# EAGLE design amiga_external_floppy_adapter_rev3 (EAGLE 9.7.0)
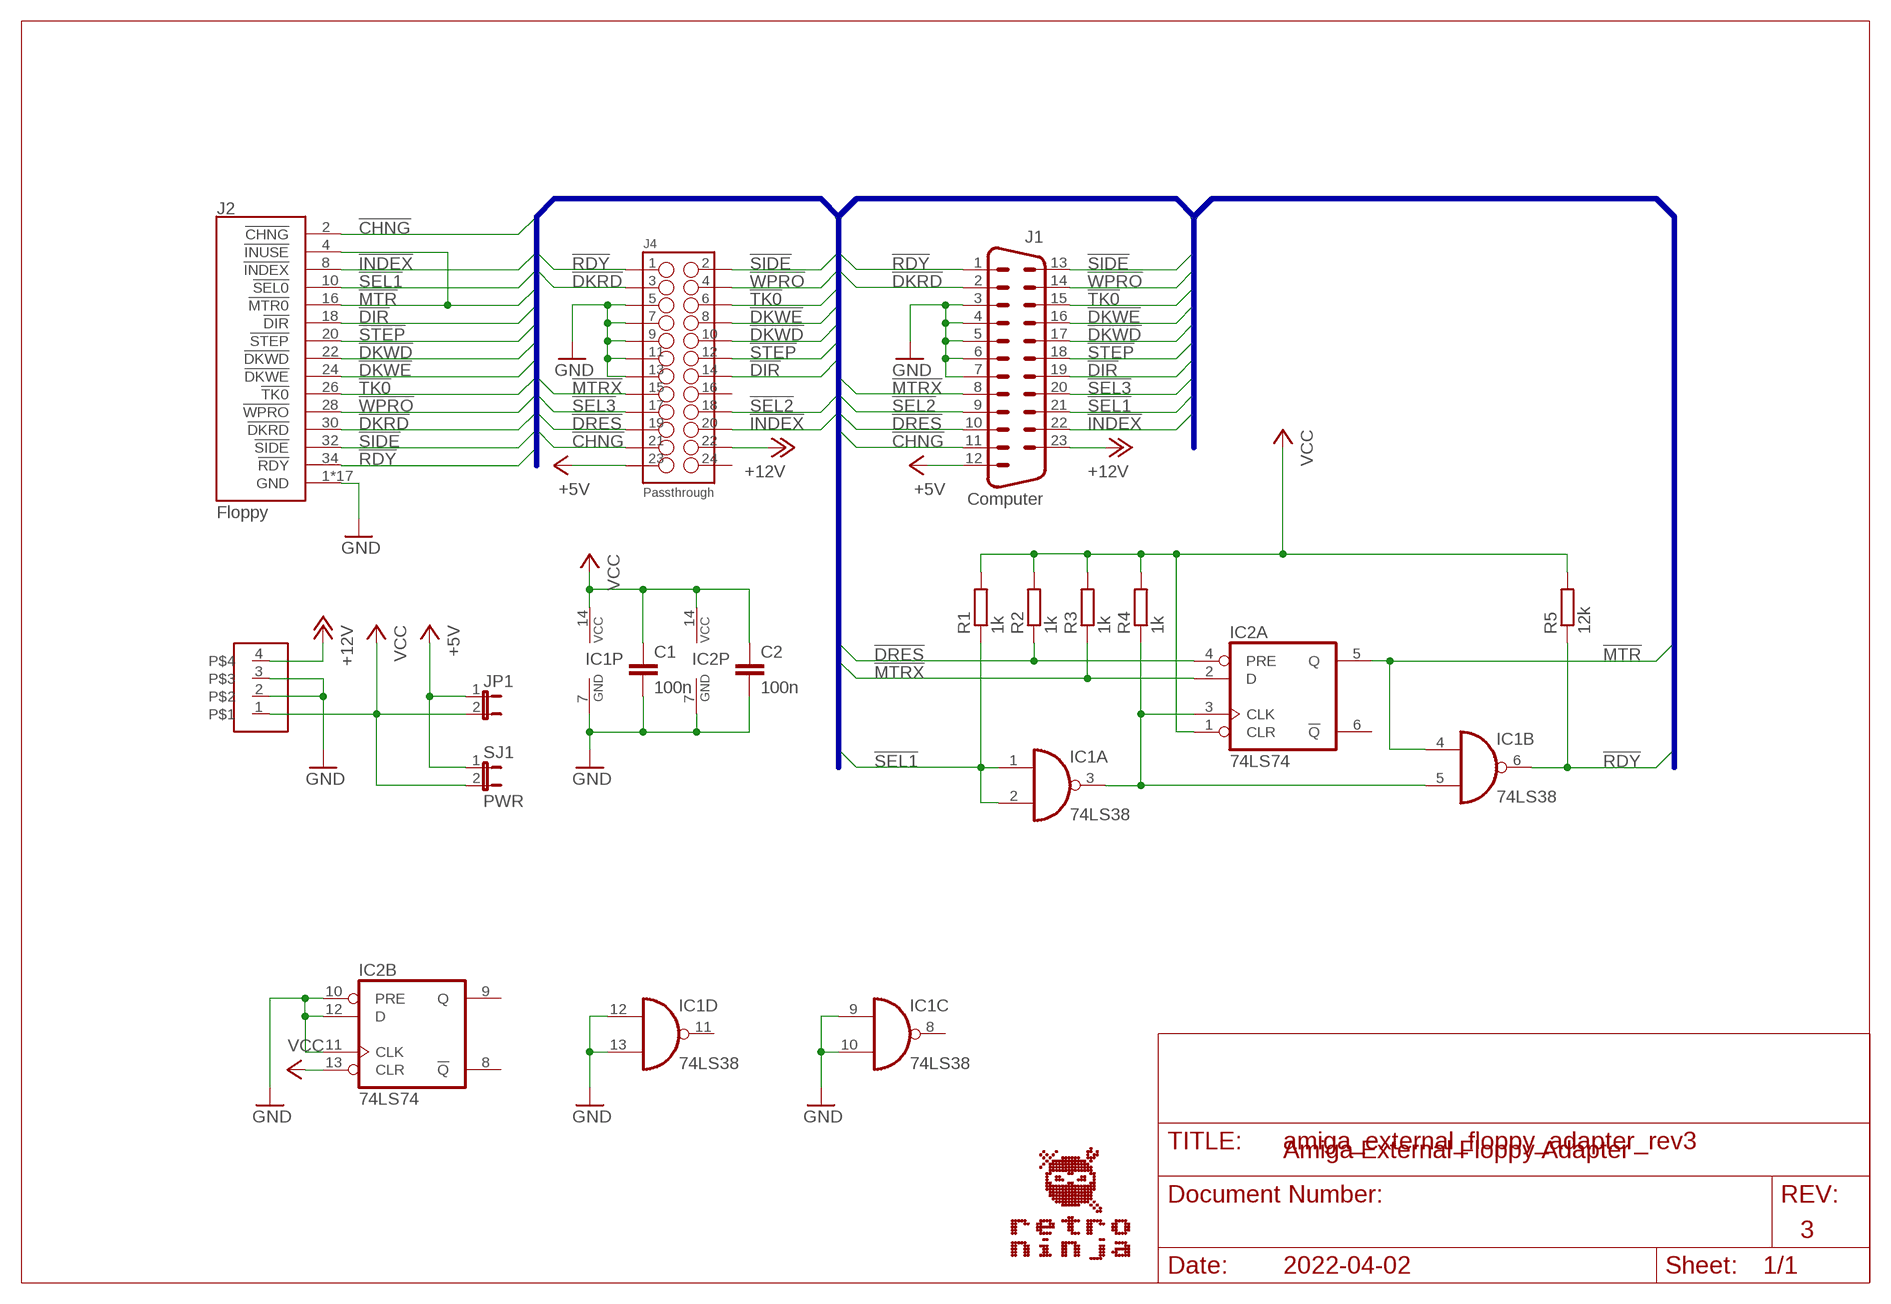
[diagram p0: schematic, sheet 1]

## Parts
C1  100n  CAPACITOR-5  [CAP_5MM_2.5X5.0_ROUND]
C2  100n  CAPACITOR-5  [CAP_5MM_2.5X5.0_ROUND]
IC1  74LS38  7438_DIL14  [DIL14]
IC2  74LS74  74LS74N  [DIL14]
J1  Computer  DSUB_M23  [DSUB_M23D]
J2  Floppy  AMIGA_FLOPPYDRV_CONNECTOR/IDC  [HEADER_2X17_WALLED]
J3  HEADER_1X4_2.50MM_RIGHT  [HEADER_1X4_2.50_RIGHT]
J4  Passthrough  HEADER_2X12/IDC  [HEADER_2X12_WALLED]
JP1  JUMPER-2  [HEADER_1X2]
R1  1k  R-EU_0207/10  [0207/10]
R2  1k  R-EU_0207/10  [0207/10]
R3  1k  R-EU_0207/10  [0207/10]
R4  1k  R-EU_0207/10  [0207/10]
R5  12k  R-EU_0207/10  [0207/10]
SJ1  PWR  JUMPER-2SJ  [SJ-2]

## Nets
!CHNG: J1.11 J2.2(!CHNG) J4.21
!DIR: J1.19 J2.18(!DIR) J4.14
!DKRD: J1.2 J2.30(!DKRD) J4.3
!DKWD: J1.17 J2.22(!DKWD) J4.10
!DKWE: J1.16 J2.24(!DKWE) J4.8
!DRES: IC2.4(A:PRE) J1.10 J4.19 R2.1
!INDEX: J1.22 J2.8(!INDEX) J4.20
!MTR: IC1.4(B:I0) IC2.5(A:Q) J2.4(!INUSE) J2.16(!MTR0)
!MTRX: IC2.2(A:D) J1.8 J4.15 R3.1
!RDY: IC1.6(B:O) J1.1 J2.34(!RDY) J4.1 R5.1
!SEL1: IC1.1(A:I0) IC1.2(A:I1) J1.21 J2.10(!SEL0) R1.1
!SEL2: J1.9 J4.18
!SEL3: J1.20 J4.17
!SIDE: J1.13 J2.32(!SIDE) J4.2
!STEP: J1.18 J2.20(!STEP) J4.12
!TK0: J1.15 J2.26(!TK0) J4.6
!WPRO: J1.14 J2.28(!WPRO) J4.4
+5V: J1.12 J4.23 JP1.1 SJ1.1
+12V: J1.23 J3.4 J4.22
GND: C1.2 C2.2 IC1.7(P:GND) IC1.9(C:I0) IC1.10(C:I1) IC1.12(D:I0) IC1.13(D:I1) IC2.7(P:GND) IC2.10(B:PRE) IC2.11(B:CLK) IC2.12(B:D) J1.3 J1.4 J1.5 J1.6 J1.7 J2.1(GND) J2.3(GND) J2.5(GND) J2.7(GND) J2.9(GND) J2.11(GND) J2.13(GND) J2.15(GND) J2.17(GND) J2.19(GND) J2.21(GND) J2.23(GND) J2.25(GND) J2.27(GND) J2.29(GND) J2.31(GND) J2.33(GND) J3.2 J3.3 J4.5 J4.7 J4.9 J4.11 J4.13
N$1: IC1.3(A:O) IC1.5(B:I1) IC2.3(A:CLK) R4.1
VCC: C1.1 C2.1 IC1.14(P:VCC) IC2.1(A:CLR) IC2.13(B:CLR) IC2.14(P:VCC) J3.1 JP1.2 R1.2 R2.2 R3.2 R4.2 R5.2 SJ1.2
Unconnected: IC1.8(C:O) IC1.11(D:O) IC2.6(A:!Q) IC2.8(B:!Q) IC2.9(B:Q) J4.16 J4.24

## Buses
DATA:!CHNG,!DIR,!DKRD,!DKWD,!DKWE,!DRES,!INDEX,!INUSE,!MTR,!MTRX,!RDY,!SEL1,!SEL2,!SEL3,!SIDE,!STEP,!TK0,!WPRO

## Notes on the sheet
- Amiga External Floppy Adapter
- 3
- 2022-04-02

## Library data of the parts
C1 C2 = Per (Fusion 360):CAPACITOR
IC1 = Per (Fusion 360):74*38
IC2 = 74xx-eu:74*74: Dual D type positive edge triggered FLIP FLOP, preset and clear
J1 = Per (Fusion 360):DSUB_M23
J2 = Per (Fusion 360):AMIGA_FLOPPYDRV_CONNECTOR
J3 = Per (Fusion 360):HEADER_1X4
J4 = Per (Fusion 360):HEADER_2X12
JP1 SJ1 = Per (Fusion 360):JUMPER-2
R1-R5 = rcl:R-EU_: RESISTOR, European symbol; SPICEPREFIX: R

## Board
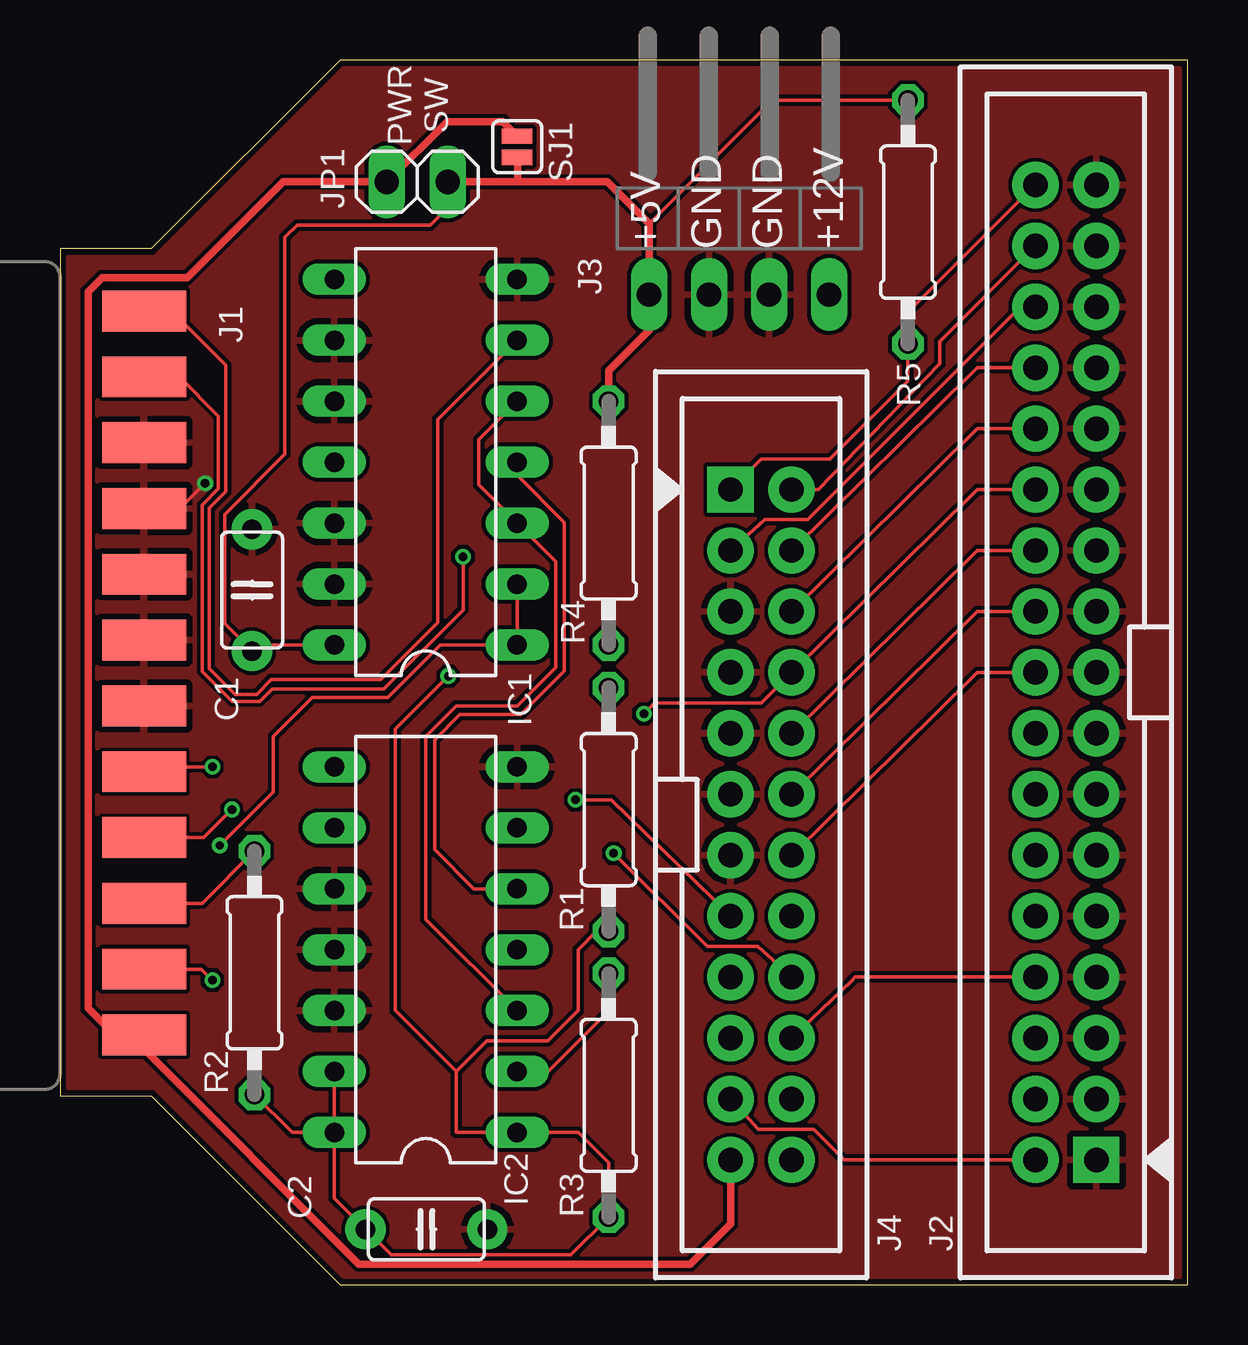
[diagram p1: board, top side]
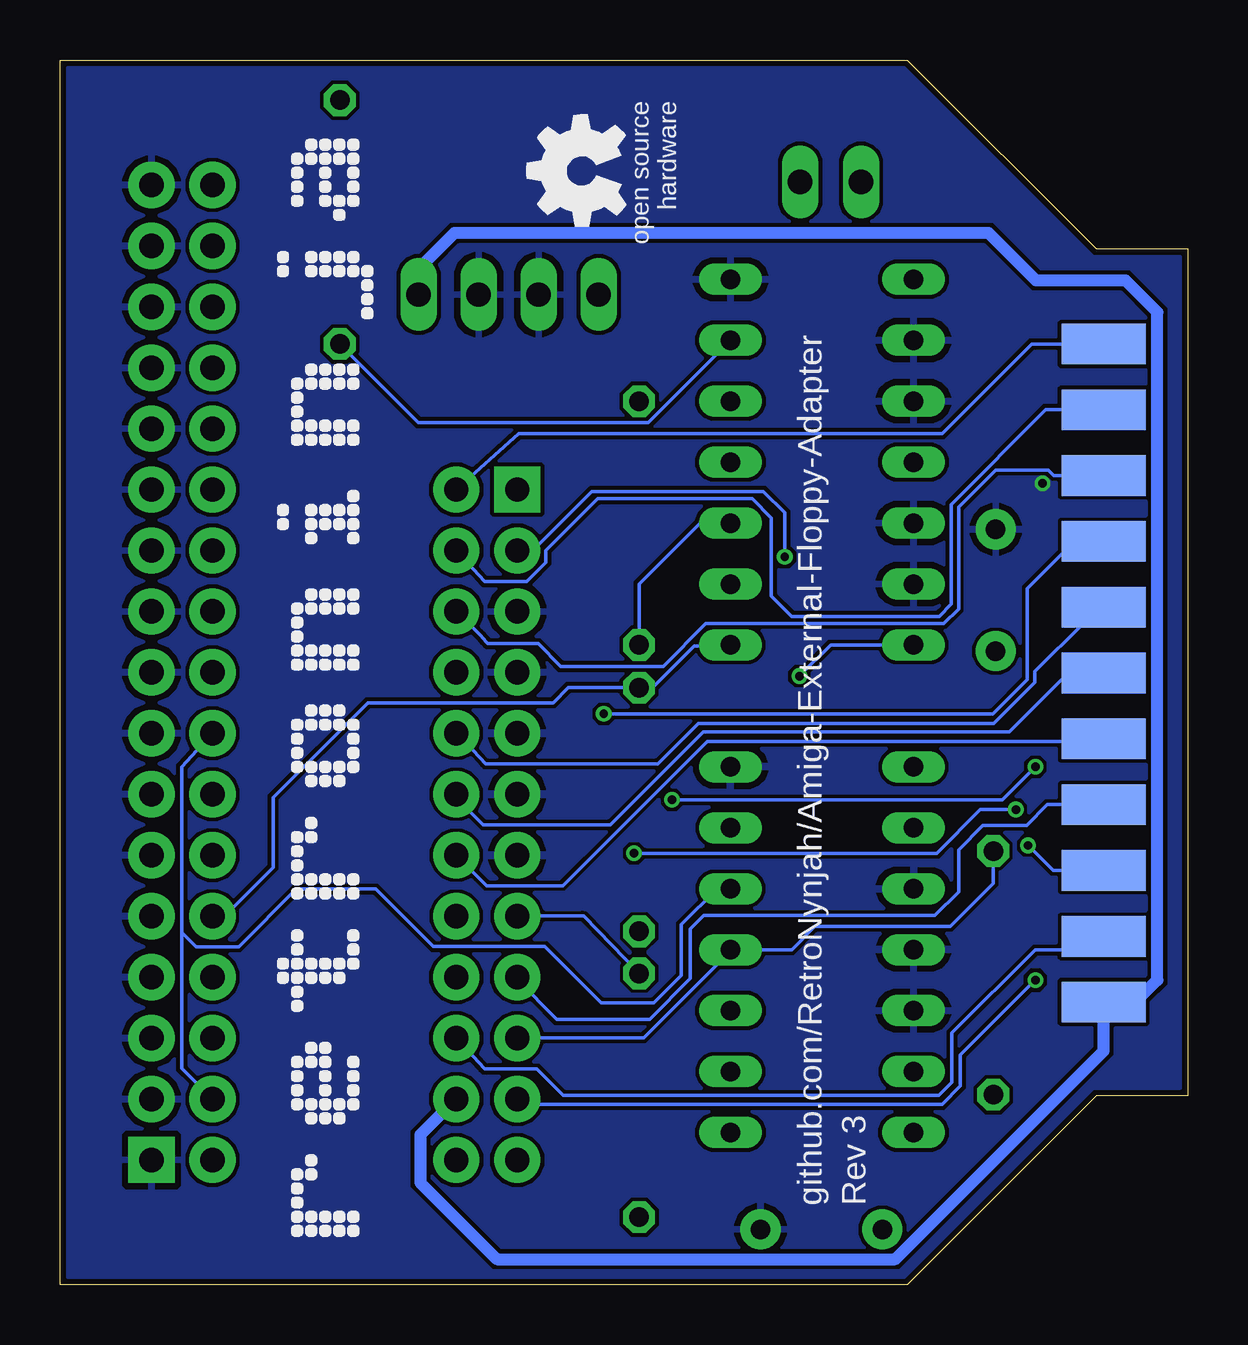
[diagram p2: board, bottom side, seen from below]

Size 46.99 x 51.05 mm. Coordinates in mm from the lower left corner, seen from the top.
Outline: 0,43.18 0,7.87 3.81,7.87 11.68,0 46.99,0 46.99,51.05 11.68,51.05 3.81,43.18 0,43.18
Copper layers (1*16): Top 0.035mm / dielectric 1.5mm / Bottom 0.035mm
Design rules "SeeedStudio_2layer_DRU_no_angle_20140221": minimum track width 6mil, minimum drill 12mil, track to track 6mil, track to pad 6mil, pad to pad 6mil, via to via 6mil, smd to smd 0mil, copper to edge 10mil, drill to drill 10mil, minimum pad ring 10mil, minimum via ring 6mil, stop-mask expansion 2mil, vias tented up to drill 100mil, thermal gap 10mil

### Footprints (pad centres in the part's own frame; a part is rotated, then mirrored left to right if it is on the bottom)
CAP_5MM_2.5X5.0_ROUND = drill 0.813 pad 1.676: 1 -2.54,0; 2 2.54,0
DIL14 = drill 0.813 long: 1 -7.62,-3.81; 2 -5.08,-3.81; 3 -2.54,-3.81; 4 0,-3.81; 5 2.54,-3.81; 6 5.08,-3.81; 7 7.62,-3.81; 8 7.62,3.81; 9 5.08,3.81; 10 2.54,3.81; 11 0,3.81; 12 -2.54,3.81; 13 -5.08,3.81; 14 -7.62,3.81
DSUB_M23D = smd 1.7 x 3.5: 1 17.729,-12.395; 2 14.986,-12.395; 3 12.243,-12.395; 4 9.5,-12.395; 5 6.756,-12.395; 6 4.013,-12.395; 7 1.27,-12.395; 8 -1.473,-12.395; 9 -4.216,-12.395; 10 -6.96,-12.395; 11 -9.703,-12.395; 12 -12.446,-12.395 | smd 1.7 x 3.5 bottom: 13 16.358,-12.395; 14 13.614,-12.395; 15 10.871,-12.395; 16 8.128,-12.395; 17 5.385,-12.395; 18 2.642,-12.395; 19 -0.102,-12.395; 20 -2.845,-12.395; 21 -5.588,-12.395; 22 -8.331,-12.395; 23 -11.074,-12.395
HEADER_2X17_WALLED = drill 1.016 pad 1.93 square: 1 -5.08,-1.27 | drill 1.016 pad 1.93: 2 -5.08,1.27; 3 -2.54,-1.27; 4 -2.54,1.27; 5 0,-1.27; 6 0,1.27; 7 2.54,-1.27; 8 2.54,1.27; 9 5.08,-1.27; 10 5.08,1.27; 11 7.62,-1.27; 12 7.62,1.27; 13 10.16,-1.27; 14 10.16,1.27; 15 12.7,-1.27; 16 12.7,1.27; 17 15.24,-1.27; 18 15.24,1.27; 19 17.78,-1.27; 20 17.78,1.27; 21 20.32,-1.27; 22 20.32,1.27; 23 22.86,-1.27; 24 22.86,1.27; 25 25.4,-1.27; 26 25.4,1.27; 27 27.94,-1.27; 28 27.94,1.27; 29 30.48,-1.27; 30 30.48,1.27; 31 33.02,-1.27; 32 33.02,1.27; 33 35.56,-1.27; 34 35.56,1.27
HEADER_1X4_2.50_RIGHT = drill 1.016 long: 1 -3.75,0; 2 -1.25,0; 3 1.25,0; 4 3.75,0
HEADER_2X12_WALLED = drill 1.016 pad 1.93 square: 1 -13.97,-1.27 | drill 1.016 pad 1.93: 2 -13.97,1.27; 3 -11.43,-1.27; 4 -11.43,1.27; 5 -8.89,-1.27; 6 -8.89,1.27; 7 -6.35,-1.27; 8 -6.35,1.27; 9 -3.81,-1.27; 10 -3.81,1.27; 11 -1.27,-1.27; 12 -1.27,1.27; 13 1.27,-1.27; 14 1.27,1.27; 15 3.81,-1.27; 16 3.81,1.27; 17 6.35,-1.27; 18 6.35,1.27; 19 8.89,-1.27; 20 8.89,1.27; 21 11.43,-1.27; 22 11.43,1.27; 23 13.97,-1.27; 24 13.97,1.27
HEADER_1X2 = drill 1.016 long: 1 -1.27,0; 2 1.27,0
0207/10 = drill 0.813 octagon: 1 -5.08,0; 2 5.08,0
SJ-2 = smd 0.635 x 1.27: 1 -0.889,0; 2 0,0

### Placement (x,y rotation side)
C1  8,28.96 90 top
C2  15.27,2.31 0 top
IC1  15.24,34.29 90 top
IC2  15.24,13.97 90 top
J1  -8.89,22.86 90 top
J2  41.91,10.29 90 top
J3  28.3,41.27 0 top
J4  29.21,19.18 270 top
JP1  14.88,45.97 0 top
R1  22.86,19.81 270 top
R2  8.1,13 270 top
R3  22.86,7.9 270 top
R4  22.86,31.75 90 top
R5  35.33,44.3 90 top
SJ1  19.05,46.99 270 top
U$1  [RETRONINJA_WORD_46X4]  33.93,2.01 90 bottom
U$2  [OSHW_5MM]  25.25,46.43 90 bottom

### Tracks (layer width: path | path; a pad name or v marks a point on that pad's centre or on a via)
!CHNG  (via drill 0.35)
  Top 0.152: J4.21 29.09,6.48 31.41,6.48 32.68,5.21 J2.2 | v6.35,12.7 5.89,13.16 J1.11
  Bottom 0.152: J4.21 27.88,7.52 10.24,7.52 9.47,8.29 9.47,9.58 v6.35,12.7
!DIR
  Top 0.152: J4.14 38.1,25.4 38.23,25.53 J2.18
  Bottom 0.152: J1.19 3.81,22.66 20.03,22.66 26.05,16.64 29.21,16.64 J4.14
!DKRD  (via drill 0.35)
  Top 0.152: J4.3 29.37,31.9 31.17,31.9 40.03,40.77 J2.30 | J1.2 4.98,37.85 6.6,36.22 6.6,33.18 5.92,32.5 5.92,25.57 7.18,24.31 8.31,24.31 8.85,24.84 13.5,24.84 16.79,28.13 v16.79,30.35
  Bottom 0.152: v16.79,30.35 v16.8,30.35 16.8,32.19 17.68,33.07 24.82,33.07 27.29,30.61 J4.3
!DKWD
  Top 0.152: J4.10 38.1,30.48 38.23,30.61 J2.22
  Bottom 0.152: J1.17 4.14,27.61 4.32,27.61 6.38,25.55 6.38,25.11 8.09,23.39 20.4,23.39 22.07,21.72 29.26,21.72 29.77,22.28 J4.10
!DKWE  (via drill 0.35)
  Top 0.152: v24.33,23.8 v24.33,23.81 24.78,24.26 29.21,24.26 J4.8 38.1,33.02 38.23,33.15 J2.24
  Bottom 0.152: J1.16 4.52,31.19 6.68,29.03 6.68,25.24 8.12,23.8 v24.33,23.8
!DRES
  Top 0.152: R2.1 5.92,15.9 J1.10
  Bottom 0.152: R2.1 8.1,16.74 9.91,14.94 15.54,14.94 16.51,13.97 IC2.4 19.05,13.91 22.67,10.29 J4.19
!INDEX
  Top 0.152: J4.20 32.99,12.67 33.15,12.83 J2.8
  Bottom 0.152: J1.22 4.27,13.97 6.35,13.97 9.83,10.49 9.83,8.45 10.38,7.9 26.02,7.9 27.12,8.99 29.3,8.99 J4.20
!MTR
  Top 0.152: IC1.4 19.05,33.74 21.01,31.78 21.01,25.58 19.2,23.77 16.66,23.77 15.61,22.72 15.61,18.14 17.24,16.51 IC2.5
  Bottom 0.152: IC2.5 19.61,16.51 21.11,15.01 21.11,12.89 22.24,11.76 24.44,11.76 26.78,14.1 31.43,14.1 33.84,16.51 37.14,16.51 39.55,14.1 41.31,14.1 41.91,14.7 | 41.91,14.7 41.91,21.59 J2.16 | J2.4 41.91,9.02 41.91,14.7
!MTRX  (via drill 0.35)
  Top 0.152: R3.1 22.78,11.33 20.34,8.89 IC2.2 | J1.8 3.71,21.59 v6.35,21.59 | v21.48,20.21 22.96,20.21 J4.15
  Bottom 0.152: v6.35,21.59 7.72,20.21 v21.48,20.21 | J4.15 25.17,15.37 R3.1
!RDY
  Top 0.152: IC1.6 15.75,36.07 15.75,27.6 13.37,25.22 8.8,25.22 8.19,24.61 7.3,24.61 6.22,25.7 6.22,32.37 6.91,33.06 6.91,38.33 4.65,40.59 J1.1 | J4.1 29.21,34.42 32.08,34.42 35.33,37.67 R5.1 35.33,40.54 J2.34
  Bottom 0.152: R5.1 32.05,35.94 22.48,35.94 IC1.6
!SEL1  (via drill 0.35)
  Top 0.152: IC1.2 IC1.1 15.83,26.67 13.65,24.48 10.51,24.48 8.89,22.86 8.89,20.55 v6.66,18.31
  Bottom 0.152: J2.10 40.13,15.37 38.1,17.4 38.1,20.32 34.16,24.26 26.44,24.26 25.81,24.89 R1.1 22.29,24.89 20.56,26.62 19.1,26.62 IC1.1 | J1.21 5.61,17.27 v6.66,18.31
!SEL2  (via drill 0.35)
  Top 0.152: J4.18 29.07,14.1 26.96,14.1 v23.07,17.99 | v7.16,19.81 6,18.64 J1.9
  Bottom 0.152: v23.07,17.99 10.46,17.99 8.64,19.81 v7.16,19.81
!SEL3
  Bottom 0.152: J4.17 27.93,12.7 26.3,11.07 22.42,11.07 20.73,12.77 20.73,14.84 20.17,15.39 10.54,15.39 9.55,16.38 9.55,18.14 8.53,19.15 6.71,19.15 5.85,20.02 J1.20
!SIDE
  Top 0.152: J4.2 31.59,33.15 36.65,38.4 36.65,39.32 J2.32
  Bottom 0.152: J4.2 27.88,35.49 10.23,35.49 6.5,39.22 J1.13
!STEP
  Top 0.152: J4.12 38.1,27.94 38.23,28.07 J2.20
  Bottom 0.152: J1.18 4.78,25.7 7.44,23.04 20.19,23.04 24.05,19.18 29.35,19.18 30.48,20.3 J4.12
!TK0
  Top 0.152: J4.6 38.1,35.56 38.23,35.69 J2.26
  Bottom 0.152: J4.6 29.49,27.08 29.23,26.8 29.16,26.72 27.07,26.72 26.12,25.78 21.86,25.78 20.08,27.56 10.16,27.56 9.55,28.17 9.55,32.41 7.99,33.97 5.82,33.97 5.58,33.73 J1.15
!WPRO
  Top 0.152: J4.4 38.1,38.1 38.23,38.23 J2.28
  Bottom 0.152: J4.4 29.3,29.31 27.55,29.31 26.75,30.11 26.75,30.61 24.59,32.77 18.15,32.77 17.35,31.97 17.35,28.7 16.51,27.87 10.36,27.87 9.86,28.37 9.86,32.53 5.92,36.47 J1.14
+5V
  Top 0.305: J4.23 27.94,2.54 26.26,0.86 12.45,0.86 3.5,9.8 J1.12 2.29,10.41 1.17,11.53 1.17,41.39 1.77,41.99 5.31,41.99 9.3,45.97 JP1.1 16.13,48.49 18.44,48.49 SJ1.1
+12V
  Bottom 0.508: J4.22 31.98,6.26 31.98,4.26 28.79,1.07 12.18,1.07 3.5,9.75 3.5,11.43 | 3.5,11.43 J1.23 | 3.5,11.43 2.54,11.43 1.27,12.7 1.27,40.54 2.59,41.86 6.32,41.86 8.3,43.84 30.56,43.84 32.05,42.35 J3.4
GND  (via drill 0.35)
  Top 0.152: J1.4 4.99,32.36 v6.05,33.41
  pour Top: 47.07,52.15 -0.08,52.15 -0.08,-0.08 47.07,-0.08
  pour Bottom: 47.07,52.15 -0.08,52.15 -0.08,-1.35 47.07,-1.35
N$1
  Top 0.152: IC2.3 15.24,15.24 15.24,22.86 16.51,24.13 19.05,24.13 20.65,25.73 20.65,30.15 IC1.3 17.45,33.35 17.45,35.23 IC1.5
  Bottom 0.152: IC1.3 20.32,31.75 22.86,29.21 R4.1
VCC  (via drill 0.35)
  Top 0.152: R2.2 9.68,6.35 IC2.14 | 16.51,8.89 16.51,6.35 IC2.1 21.59,6.35 22.86,5.08 R3.2 21.29,1.25 13.79,1.25 C2.1 11.43,3.61 IC2.14 | 16.51,8.89 17.78,10.16 20.32,10.16 21.59,11.43 21.59,13.97 22.35,14.73 R1.2 | 16.51,8.89 13.97,11.43 13.97,23.16 v16.18,25.38 | IC2.14 IC2.13 | R5.2 29.69,49.38 24.55,44.24 | IC1.14 8.26,26.67 C1.1 6.86,27.56 6.86,32.12 9.37,34.63 9.37,43.66 9.88,44.17 15.42,44.17 16.15,44.91 JP1.2
  Top 0.305: R4.2 22.86,38.1 24.55,39.79 J3.1 24.55,44.24 22.81,45.97 19.07,45.97 | 19.07,45.97 JP1.2 | SJ1.2 19.07,46.97 19.07,45.97
  Bottom 0.152: v16.18,25.38 14.88,26.67 IC1.14

### Text on the board
tPlace: PWR / SW | +5V | GND | GND | +12V
bPlace: Rev 3 | github.com/RetroNynjah/Amiga-External-Floppy-Adapter